# Altium schematic sheet SH19 - SD_MMC MUX.SchDoc
size 386 x 246 mm
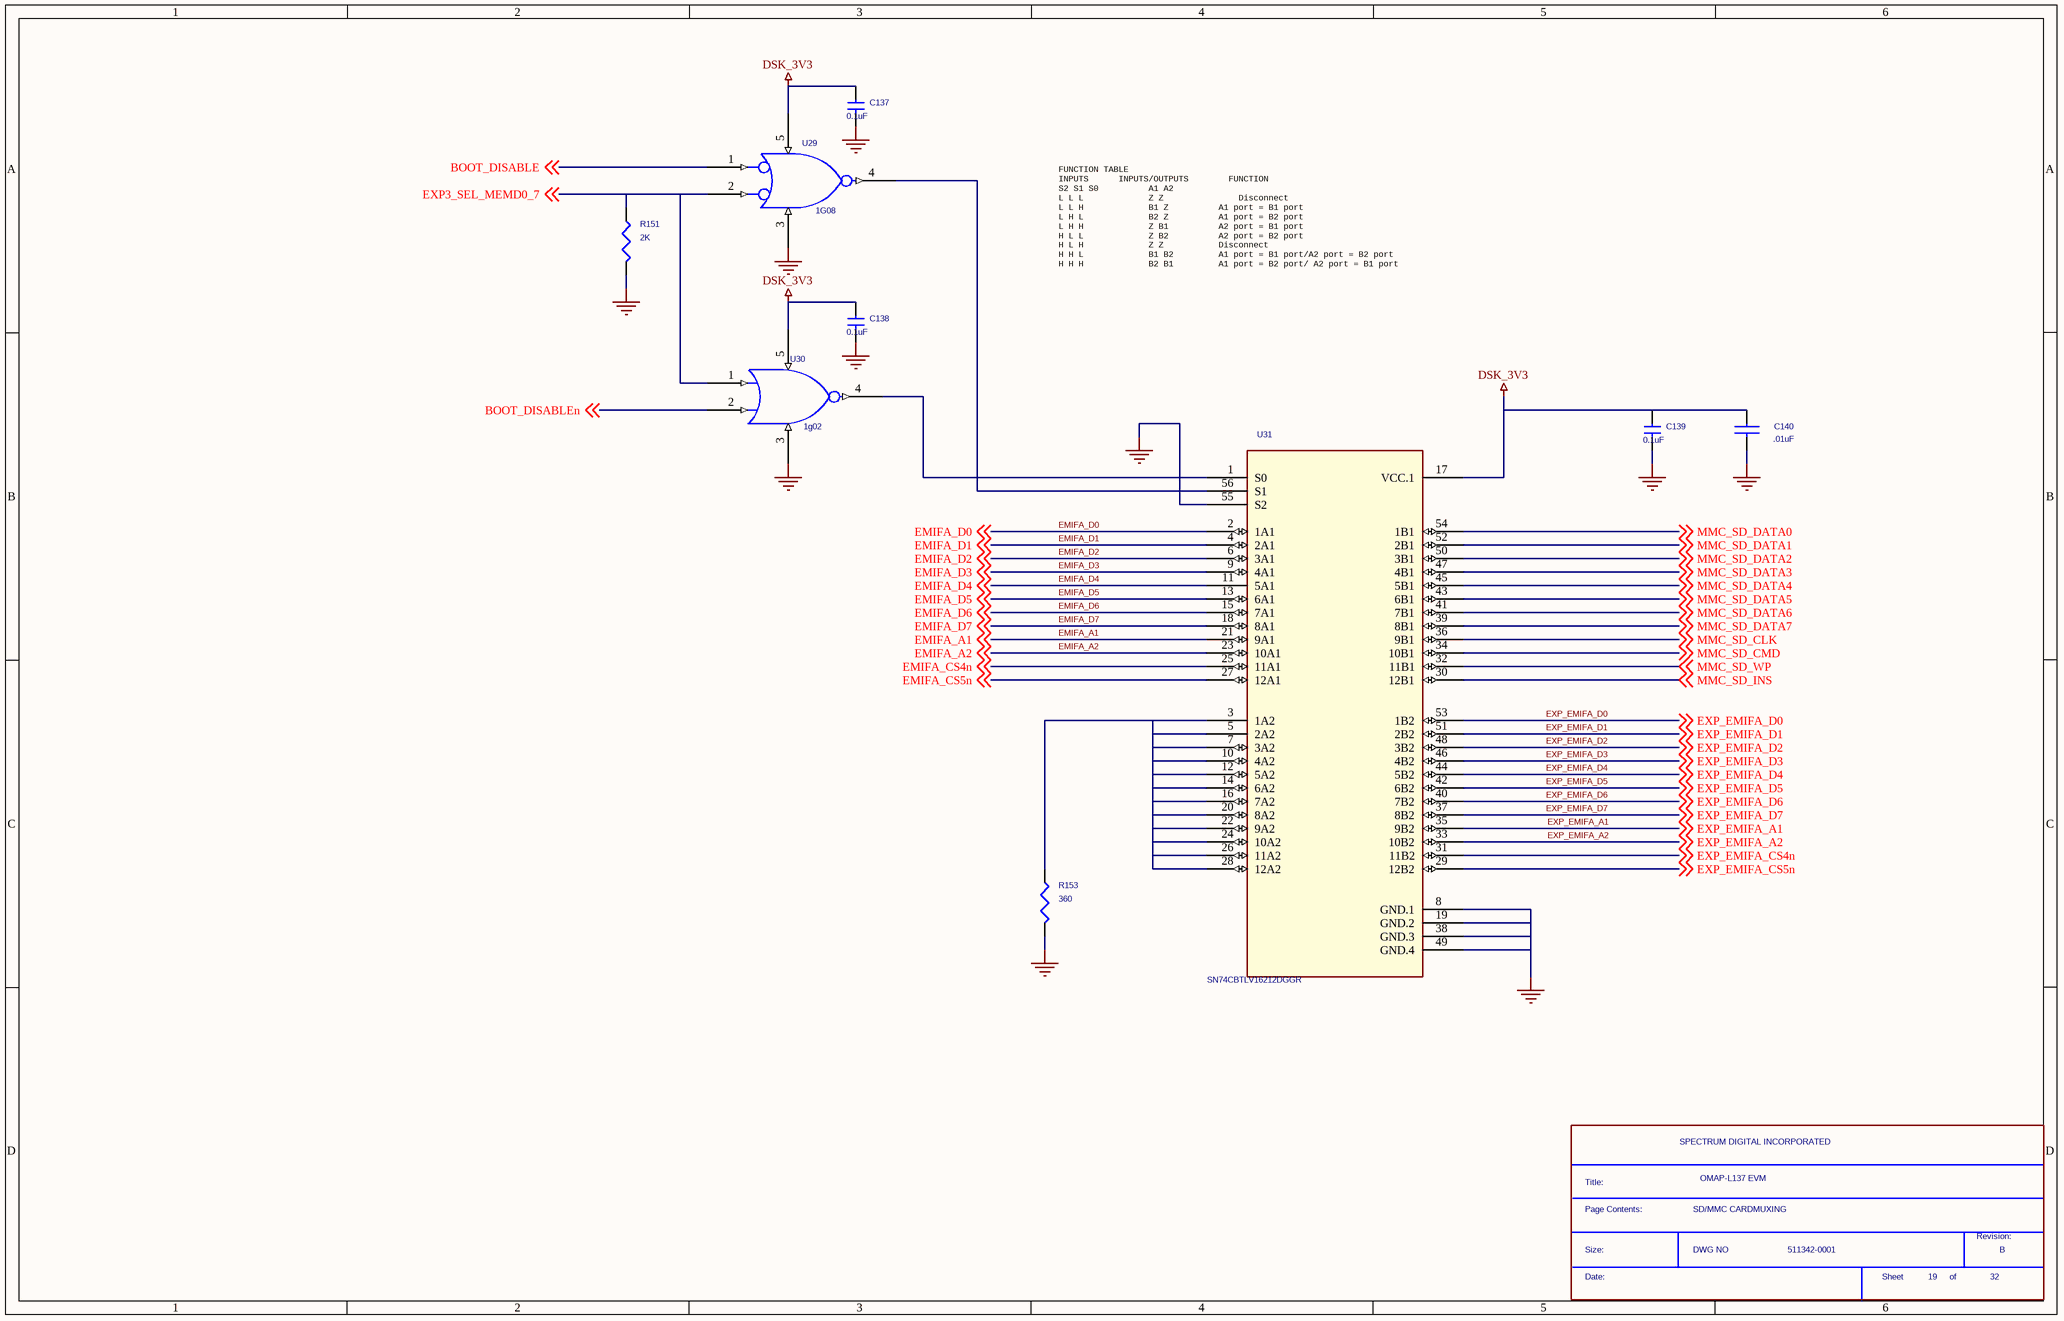
[diagram p0: SH19 - SD_MMC MUX.SchDoc]

## Parts
*  Page Contents:: SD/MMC CARDMUXING  RevCode: B  Title: OMAP-L137 EVM  OrgName: SPECTRUM DIGITAL INCORPORATED  Doc: 511342-0001  Page Number: 19  Page Count: 32  (hidden comment: SDTitleBlock)  (graphical)
C137  0.1uF  [c402-25]
C138  0.1uF  [c402-25]
C139  0.1uF  [c402-25]
C140  .01uF  [c402-25]
R151  2K  [r402-25]
R153  360  [r402-25]
U29  1G08  [SO5]
U30  1g02  [dck-5]
U31  SN74CBTLV16212DGGR  [56 pin TSSOP]

## Nets
DSK_3V3: C137.1 C138.1 C139.1 C140.1 U29.5(VCC) U30.5(VCC) U31.17(VCC.1)
GND: C137.2 C138.2 C139.2 C140.2 R151.2 R153.2 U29.3(GND) U30.3(GND) U31.8(GND.1) U31.19(GND.2) U31.38(GND.3) U31.49(GND.4) U31.55(S2)
BOOT_DISABLE: U29.1(B) ; off-sheet BOOT_DISABLE
BOOT_DISABLEn: U30.2(A) ; off-sheet BOOT_DISABLEn
EMIFA_A1: U31.21(9A1) ; off-sheet EMIFA_A1
EMIFA_A2: U31.23(10A1) ; off-sheet EMIFA_A2
EMIFA_CS4n: U31.25(11A1) ; off-sheet EMIFA_CS4n
EMIFA_CS5n: U31.27(12A1) ; off-sheet EMIFA_CS5n
EMIFA_D0: U31.2(1A1) ; off-sheet EMIFA_D0
EMIFA_D1: U31.4(2A1) ; off-sheet EMIFA_D1
EMIFA_D2: U31.6(3A1) ; off-sheet EMIFA_D2
EMIFA_D3: U31.9(4A1) ; off-sheet EMIFA_D3
EMIFA_D4: U31.11(5A1) ; off-sheet EMIFA_D4
EMIFA_D5: U31.13(6A1) ; off-sheet EMIFA_D5
EMIFA_D6: U31.15(7A1) ; off-sheet EMIFA_D6
EMIFA_D7: U31.18(8A1) ; off-sheet EMIFA_D7
EXP3_SEL_MEMD0_7: R151.1 U29.2(A) U30.1(B) ; off-sheet EXP3_SEL_MEMD0_7
EXP_EMIFA_A1: U31.35(9B2) ; off-sheet EXP_EMIFA_A1
EXP_EMIFA_A2: U31.33(10B2) ; off-sheet EXP_EMIFA_A2
EXP_EMIFA_CS4n: U31.31(11B2) ; off-sheet EXP_EMIFA_CS4n
EXP_EMIFA_CS5n: U31.29(12B2) ; off-sheet EXP_EMIFA_CS5n
EXP_EMIFA_D0: U31.53(1B2) ; off-sheet EXP_EMIFA_D0
EXP_EMIFA_D1: U31.51(2B2) ; off-sheet EXP_EMIFA_D1
EXP_EMIFA_D2: U31.48(3B2) ; off-sheet EXP_EMIFA_D2
EXP_EMIFA_D3: U31.46(4B2) ; off-sheet EXP_EMIFA_D3
EXP_EMIFA_D4: U31.44(5B2) ; off-sheet EXP_EMIFA_D4
EXP_EMIFA_D5: U31.42(6B2) ; off-sheet EXP_EMIFA_D5
EXP_EMIFA_D6: U31.40(7B2) ; off-sheet EXP_EMIFA_D6
EXP_EMIFA_D7: U31.37(8B2) ; off-sheet EXP_EMIFA_D7
MMC_SD_CLK: U31.36(9B1) ; off-sheet MMC_SD_CLK
MMC_SD_CMD: U31.34(10B1) ; off-sheet MMC_SD_CMD
MMC_SD_DATA0: U31.54(1B1) ; off-sheet MMC_SD_DATA0
MMC_SD_DATA1: U31.52(2B1) ; off-sheet MMC_SD_DATA1
MMC_SD_DATA2: U31.50(3B1) ; off-sheet MMC_SD_DATA2
MMC_SD_DATA3: U31.47(4B1) ; off-sheet MMC_SD_DATA3
MMC_SD_DATA4: U31.45(5B1) ; off-sheet MMC_SD_DATA4
MMC_SD_DATA5: U31.43(6B1) ; off-sheet MMC_SD_DATA5
MMC_SD_DATA6: U31.41(7B1) ; off-sheet MMC_SD_DATA6
MMC_SD_DATA7: U31.39(8B1) ; off-sheet MMC_SD_DATA7
MMC_SD_INS: U31.30(12B1) ; off-sheet MMC_SD_INS
MMC_SD_WP: U31.32(11B1) ; off-sheet MMC_SD_WP
NetR153_1: R153.1 U31.3(1A2) U31.5(2A2) U31.7(3A2) U31.10(4A2) U31.12(5A2) U31.14(6A2) U31.16(7A2) U31.20(8A2) U31.22(9A2) U31.24(10A2) U31.26(11A2) U31.28(12A2)
NetU29_4: U29.4(Y) U31.56(S1)
NetU30_4: U30.4(Y) U31.1(S0)

## Notes on the sheet
- FUNCTION TABLE
  INPUTS      INPUTS/OUTPUTS        FUNCTION
  S2 S1 S0          A1 A2
  L L L             Z Z               Disconnect
  L L H             B1 Z          A1 port = B1 port
  L H L             B2 Z          A1 port = B2 port
  L H H             Z B1          A2 port = B1 port
  H L L             Z B2          A2 port = B2 port
  H L H             Z Z           Disconnect
  H H L             B1 B2         A1 port = B1 port/A2 port = B2 port
  H H H             B2 B1         A1 port = B2 port/ A2 port = B1 port
- (in symbol SDTitleBlock) Title:; Page Contents:; Revision:; Size:; DWG NO; Date:; Sheet; of

## Library data of the parts
C137-C139 = CAP NP_1: Part #: 101587-1100R
C140 = CAP NP_0: Part #: 101587-1101R
R151 = R: Part #: 101370-2002R
R153 = R: Part #: 101370-3601R
U29 = 1G08: Part #: 101057-0008R
U30 = 1g02_0: Part #: 101057-0002R
U31 = SN74CBT16212DGGR: Part #: 102693-0001R; SD PCB Footprint: TSSOP56